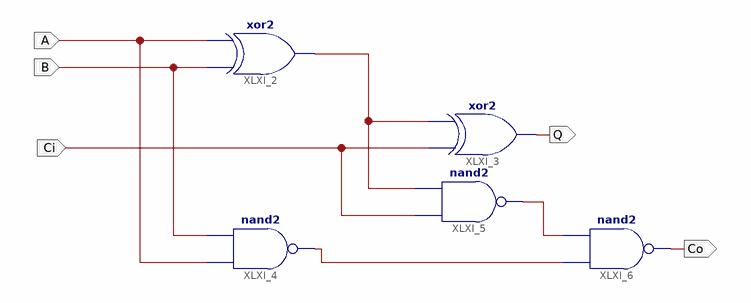
[diagram p0: schematic sheet 1]
// Xilinx ISE schematic FA.sch (spartan6) as structural Verilog: 5 symbols, 5 ports
module FA (
  input  Ci,
  input  B,
  input  A,
  output Q,
  output Co
);

  wire XLXN_4, XLXN_9, XLXN_10;

  xor XLXI_2 (XLXN_4, B, A);
  xor XLXI_3 (Q, Ci, XLXN_4);
  nand XLXI_4 (XLXN_9, A, B);
  nand XLXI_5 (XLXN_10, Ci, XLXN_4);
  nand XLXI_6 (Co, XLXN_9, XLXN_10);
endmodule
